# EAGLE design PTC Control V2 (EAGLE 8.6.3)
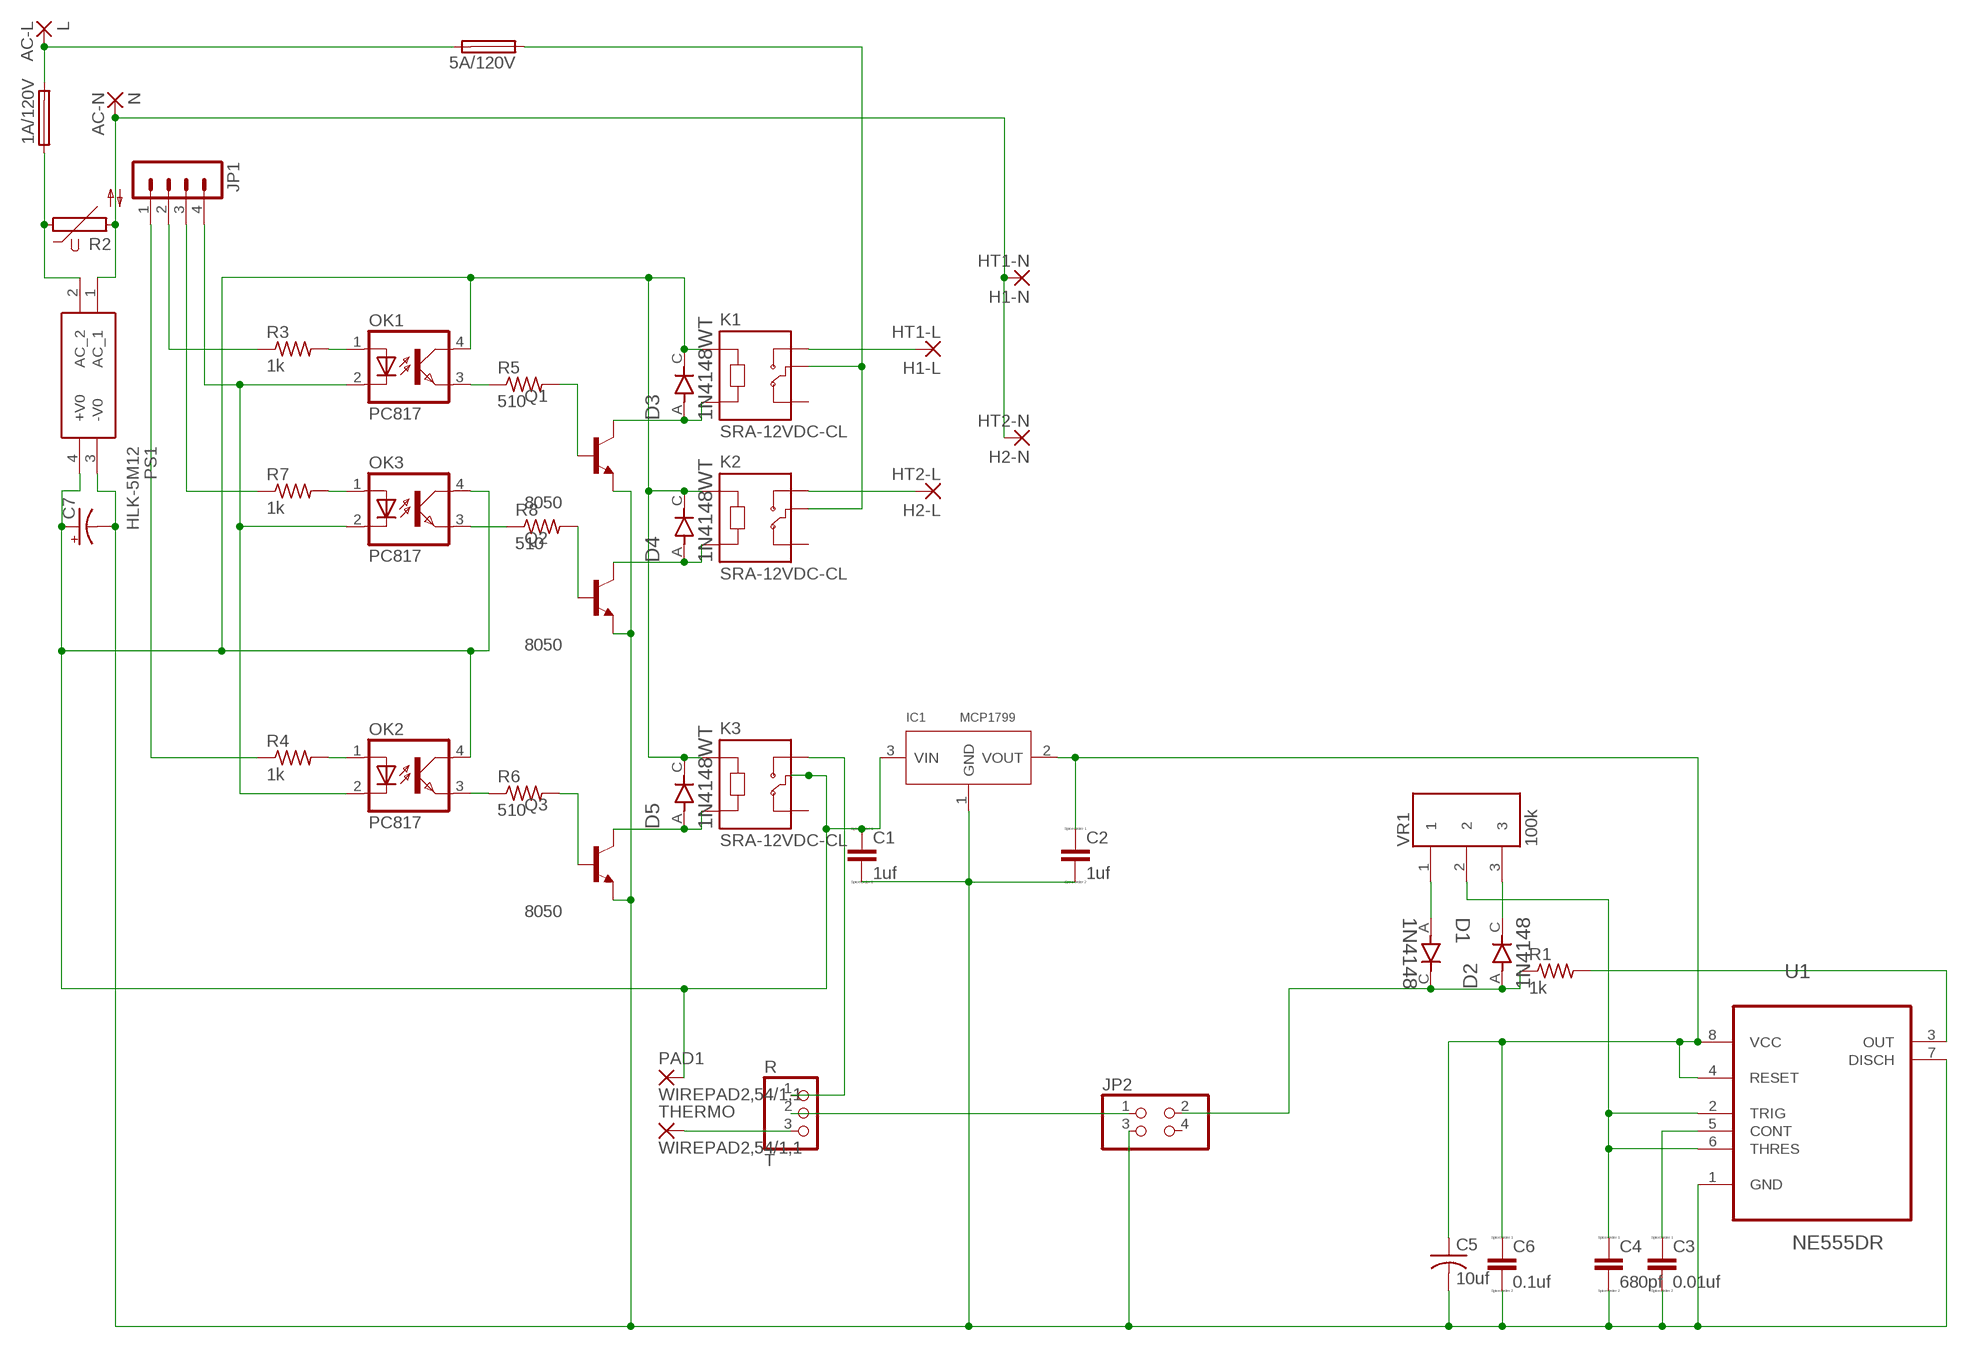
[diagram p0: schematic, sheet 1]

## Parts
1A/120V  SH25  [SH25]
5A/120V  SH25  [SH25]
C1  1uf  C  [C0805]
C2  1uf  C  [C0805]
C3  0.01uf  C  [C0805]
C4  680pf  C  [C0805]
C5  10uf  C-USC1206  [C1206]
C6  0.1uf  C  [C0805]
C7  CPOL-USE3.5-8  [E3,5-8]
D1  1N4148  1N4148WT  [SODFL1608X70N]
D2  1N4148  1N4148WT  [SODFL1608X70N]
D3  1N4148WT  [SODFL1608X70N]
D4  1N4148WT  [SODFL1608X70N]
D5  1N4148WT  [SODFL1608X70N]
H1-L  HT1-L  WIREPAD3,17/1,2  [3,17/1,2]
H1-N  HT1-N  WIREPAD3,17/1,2  [3,17/1,2]
H2-L  HT2-L  WIREPAD3,17/1,2  [3,17/1,2]
H2-N  HT2-N  WIREPAD3,17/1,2  [3,17/1,2]
IC1  MCP1799  PMIC-LDO-XC6206P252MR-G(SOT23)  [SOT-23]
JP1  MA04-1  [MA04-1]
JP2  PINHD-2X2  [2X02]
K1  SRA-12VDC-CL  1-1721150-3  [RELAY_1-1721150-3]
K2  SRA-12VDC-CL  1-1721150-3  [RELAY_1-1721150-3]
K3  SRA-12VDC-CL  1-1721150-3  [RELAY_1-1721150-3]
L  AC-L  WIREPAD3,81/1,4  [3,81/1,4]
N  AC-N  WIREPAD3,81/1,4  [3,81/1,4]
OK1  PC817  [DIL04]
OK2  PC817  [DIL04]
OK3  PC817  [DIL04]
PAD1  WIREPAD2,54/1,1  [2,54/1,1]
PS1  HLK-5M12  [HLK5M12]
Q1  8050  MMSS8050-H-TP  [TRANS_MMSS8050-H-TP]
Q2  8050  MMSS8050-H-TP  [TRANS_MMSS8050-H-TP]
Q3  8050  MMSS8050-H-TP  [TRANS_MMSS8050-H-TP]
R  T  PINHD-1X3  [1X03]
R1  1k  R-US_R0805  [R0805]
R2  S10K250  [S10K250]
R3  1k  R-US_R0805  [R0805]
R4  1k  R-US_R0805  [R0805]
R5  510  R-US_R0805  [R0805]
R6  510  R-US_R0805  [R0805]
R7  1k  R-US_R0805  [R0805]
R8  510  R-US_R0805  [R0805]
THERMO  WIREPAD2,54/1,1  [2,54/1,1]
U1  NE555DR  [SOIC127P600X175-8N]
VR1  100k  416XA503P  [TRIM_416XA503P]

## Nets
GND: C1.2 C2.2 C3.2 C4.2 C5.2 C6.2 C7.- IC1.1(GND) JP2.3 PS1.3(-V0) Q1.2(E) Q2.2(E) Q3.2(E) U1.1(GND) U1.7(DISCH)
N$1: JP2.1 R.2
N$2: C3.1 U1.5(CONT)
N$3: D1.A VR1.1
N$4: D2.C VR1.3
N$5: 1A/120V.1 PS1.2(AC_2) R2.1
N$6: R1.2 U1.3(OUT)
N$7: C4.1 U1.2(TRIG) U1.6(THRES) VR1.2
N$8: H1-N.1(P) H2-N.1(P) N.1(P) PS1.1(AC_1) R2.2
N$9: OK3.3(EMIT) R8.1
N$10: 5A/120V.1 K1.COM K2.COM
N$11: OK1.1(A) R3.2
N$12: OK2.1(A) R4.2
N$13: JP1.4 OK1.2(C) OK2.2(C) OK3.2(C)
N$14: JP1.1 R4.1
N$15: JP1.2 R3.1
N$16: OK1.3(EMIT) R5.1
N$17: OK2.3(EMIT) R6.1
N$18: Q3.1(B) R6.2
N$19: Q2.1(B) R8.2
N$20: JP1.3 R7.1
N$21: D4.A K2.A2 Q2.3(C)
N$23: D5.A K3.A2 Q3.3(C)
N$24: OK3.1(A) R7.2
N$25: Q1.1(B) R5.2
N$26: H1-L.1(P) K1.NO
N$27: D3.A K1.A2 Q1.3(C)
N$28: H2-L.1(P) K2.NO
N$29: 1A/120V.2 5A/120V.2 L.1(P)
N$30: K3.NO R.1
N$31: R.3 THERMO.1(P)
N$32: C1.1 C7.+ D3.C D4.C D5.C IC1.3(VIN) K1.A1 K2.A1 K3.A1 K3.COM OK1.4(COL) OK2.4(COL) OK3.4(COL) PAD1.1(P) PS1.4(+V0)
PWM-SIG: D1.C D2.A JP2.2 R1.1
VCC-5V: C2.1 C5.1 C6.1 IC1.2(VOUT) U1.4(RESET) U1.8(VCC)
Unconnected: JP2.4 K1.NC K2.NC K3.NC

## Library data of the parts
1A/120V 5A/120V = fuse:SH25: FUSE HOLDER grid 25 mm, OGN0031 8211, Schurter (Buerklin); MF: SCHURTER; MPN: 0031.8211; OC_FARNELL: 1162741; OC_NEWARK: 96B9380
C1-C4 C6 = eagle-ltspice:C: CAPACITOR, European symbol; SPICEMODEL: NONE; SPICEPREFIX: C
C5 = adafruit:C-US: CAPACITOR, American symbol
C7 = adafruit:CPOL-US: POLARIZED CAPACITOR, American symbol
D1-D5 = 1N4148WT:1N4148WT: Diode Switching 100V 0.125A 2-Pin SOD-523; AVAILABILITY: Unavailable; DESCRIPTION: Diode Standard 75V 200mA Surface Mount SOD-523F; MF: ON Semiconductor; MP: 1N4148WT; PACKAGE: S-9 Good-Ark; PRICE: None
H1-L H1-N H2-L H2-N L N PAD1 THERMO = wirepad:WIREPAD: Wire PAD connect wire on PCB
IC1 = PMIC-LDO-XC6206P252MR-G_SOT23_:PMIC-LDO-XC6206P252MR-G(SOT23): 310030014; AVAILABILITY: Unavailable; DESCRIPTION: Linear Voltage Regulator IC 1 Output 150mA SOT-23; MF: Torex; MP: XC6206P252MR-G; PACKAGE: SOT-23-3 Torex; PRICE: None
JP1 = con-lstb:MA04-1: PIN HEADER; OC_FARNELL: unknown; OC_NEWARK: unknown
JP2 = pinhead:PINHD-2X2: PIN HEADER
K1-K3 = PCB Relay-Small:1-1721150-3: ORWH Series Miniature PCB Relay with Wash Tight 1-Pole 1-Form C 1 CO 12 VDC 400 Ohm 360 mW Silver Zinc Oxide; AVAILABILITY: Unavailable; COMMENT: 1-1721150-3; DESCRIPTION: General Purpose Relay, ORWH Series, Power, Non Latching, SPDT, 12 VDC, 10 A; MF: TE Connectivity; MP: ORWH-SH-112D1F,000; PACKAGE: None; PRICE: None; TE_PURCHASE_URL: https://www.te.com/usa-en/product-1-1721150-3.html?te_bu=Cor&te_type=disp&te_campaign=seda_glo_cor-seda-global-disp-prtnr-fy19-seda-model-bom-cta_sma-317_1&elqCampaignId=32493
OK1-OK3 = optocoupler:PC817: SHARP OPTO COUPLER; MPN: PC817X4J000F; OC_FARNELL: 9707727; OC_NEWARK: 97K7059
PS1 = HLK-5M12:HLK-5M12: Power Module Source: Datasheet <http://www.hlktech.net/product_detail.php?ProId=64>; DESCRIPTION: Power Module; HEIGHT: 18mm; MANUFACTURER_NAME: Hi-Link; MANUFACTURER_PART_NUMBER: HLK-5M12
Q1-Q3 = MMSS8050-H-TP:MMSS8050-H-TP: MMSS8050-H Series 25 V 1.5 A NPN Silicon Plastic-Encapsulate Transistor-SOT-23; AVAILABILITY: Unavailable; DESCRIPTION: Bipolar _BJT_ Transistor NPN 25V 1.5A 100MHz 625mW Surface Mount SOT-23; MF: Micro Commercial; MP: MMSS8050-H-TP; PACKAGE: SOT-23 Micro Commercial; PRICE: None
R = pinhead:PINHD-1X3: PIN HEADER
R1 R3-R8 = adafruit:R-US_: RESISTOR, American symbol
R2 = varistor:S10K250: VARISTOR
U1 = TEL2426-Cust:NE555DR: PRECISION TIMERS; MPN: NE555DR; OC_FARNELL: 7527482; OC_NEWARK: 75C4440; PACKAGE: SOIC-8; SUPPLIER: Texas Instruments
VR1 = 416XA503P:416XA503P: TRIMMER 50K OHM 0.2W TH; AVAILABILITY: Unavailable; COMMENT: 1623895-9; DESCRIPTION: Res Cermet Trimmer 50K Ohm 25% 0.2W_1/5W_ 1_Elec_/1_Mech_Turn _6.8 X 7.45 X 8.4mm_ Pin Thru-Hole; MF: TE Connectivity; MP: 416XA503P; PACKAGE: TE Connectivity; PRICE: None; TE_PURCHASE_URL: https://www.te.com/usa-en/product-1623895-9.html?te_bu=Cor&te_type=disp&te_campaign=seda_glo_cor-seda-global-disp-prtnr-fy19-seda-model-bom-cta_sma-317_1&elqCampaignId=32493

## Board
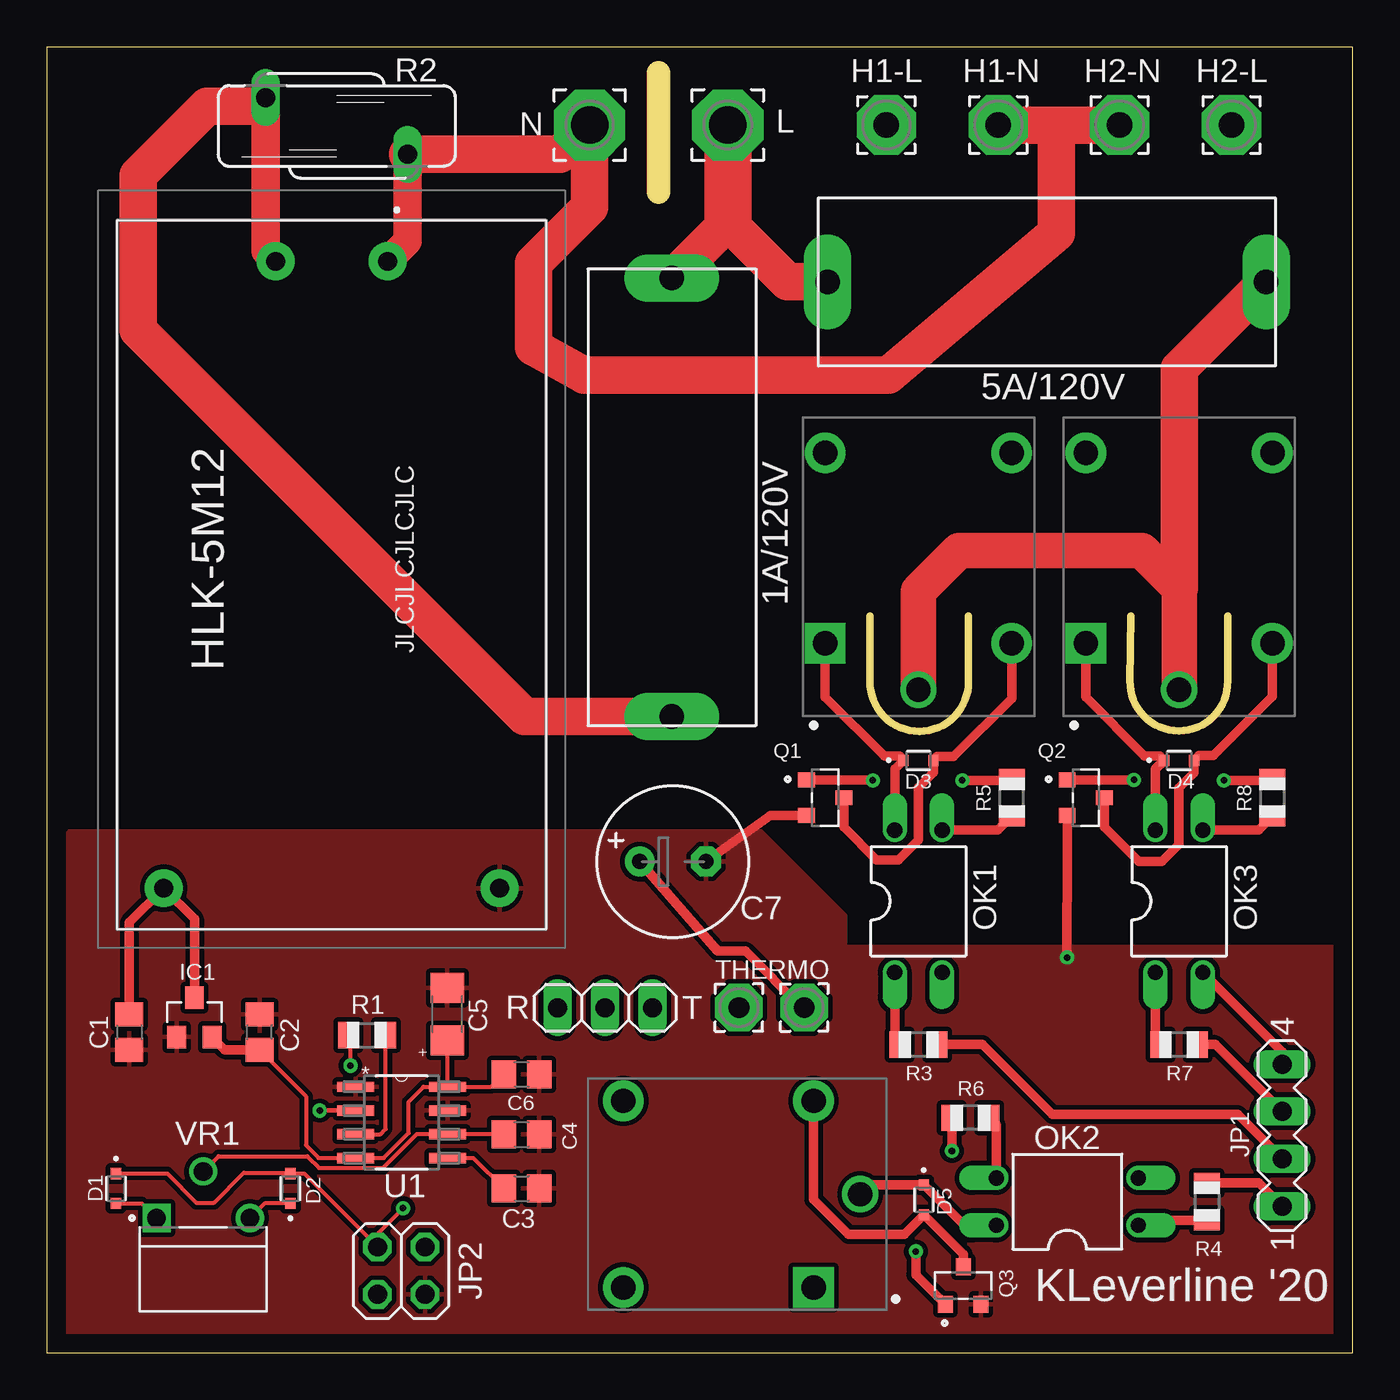
[diagram p1: board, top side]
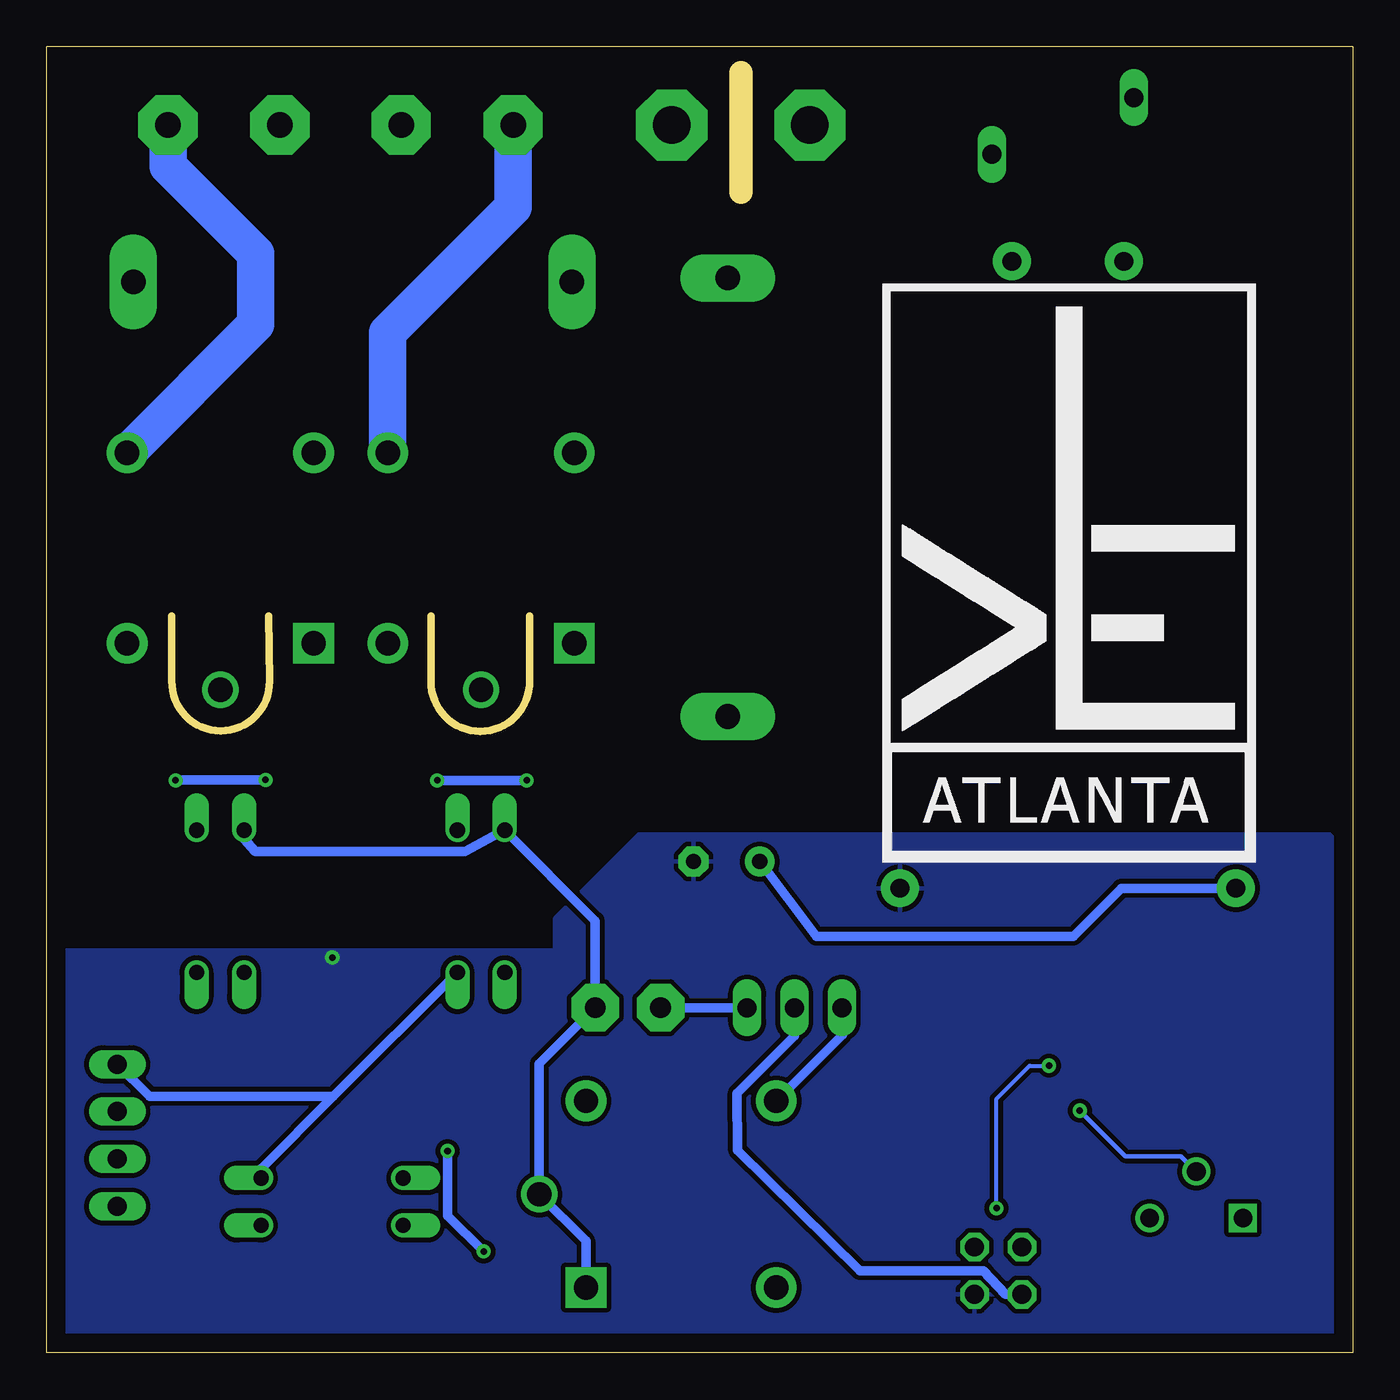
[diagram p2: board, bottom side, seen from below]

Size 70 x 70 mm. Coordinates in mm from the lower left corner, seen from the top.
Outline: 44.12,39.5 44.12,36 arc182 49.4,36 49.4,39.5
Outline: 58.09,39.5 58.06,36 arc182 63.29,36 63.29,39.5
Outline: 32.8,68.6 32.8,62.2
Outline: 0,0 70,0 70,70 0,70 0,0
Copper layers (1*16): Top 0.035mm / dielectric 1.5mm / Bottom 0.035mm
Design rules "default": minimum track width 6mil, minimum drill 0.35mm, track to track 6mil, track to pad 6mil, pad to pad 6mil, via to via 6mil, smd to smd 6mil, copper to edge 40mil, drill to drill 6mil, minimum pad ring 10mil, minimum via ring 8mil, stop-mask expansion 4mil, vias tented up to drill 0mil, thermal gap 10mil

### Footprints (pad centres in the part's own frame; a part is rotated, then mirrored left to right if it is on the bottom)
SH25 = drill 1.321 pad 2.54 long: 1 -11.75,0; 2 11.75,0
C0805 = smd 1.3 x 1.5: 1 -0.95,0; 2 0.95,0
C1206 = smd 1.6 x 1.8: 1 -1.4,0; 2 1.4,0
E3,5-8 = drill 0.813 pad 1.6: + -1.778,0 | drill 0.813 pad 1.6 octagon: - 1.778,0
SODFL1608X70N = smd 0.61 x 0.61: A 0.8,0; C -0.8,0
3,17/1,2 = drill 1.372 pad 3.175 octagon: 1 0,0
SOT-23 = smd 1.016 x 1.2: 1 -0.95,-1.06; 2 0.95,-1.06; 3 0,1.06
MA04-1 = drill 1.016 long: 1 -3.81,0; 2 -1.27,0; 3 1.27,0; 4 3.81,0
2X02 = drill 1.016 octagon: 1 -1.27,-1.27; 2 -1.27,1.27; 3 1.27,-1.27; 4 1.27,1.27
RELAY_1-1721150-3 = drill 1.3 pad 2.184 square: A1 -4.1,5 | drill 1.3 pad 2.184: A2 -4.1,-5; NC 6.1,5; NO 6.1,-5 | drill 1.3: COM -6.6,0
3,81/1,4 = drill 2 pad 3.81 octagon: 1 0,0
DIL04 = drill 0.813 offset: 1 -1.27,-3.81; 2 1.27,-3.81; 3 1.27,3.81; 4 -1.27,3.81
2,54/1,1 = drill 1.118 pad 2.54 octagon: 1 0,0
HLK5M12 = drill 1 pad 2.032: 1 0,0; 2 0,-6; 3 33.6,6; 4 33.6,-12
TRANS_MMSS8050-H-TP = smd 0.9 x 0.8: 1 -1,0.95; 2 -1,-0.95; 3 1,0
1X03 = drill 1.016 long: 1 -2.54,0; 2 0,0; 3 2.54,0
R0805 = smd 1.1 x 1.4: 1 -1,0; 2 1,0
S10K250 = drill 1.016 long: 1 -1.524,-3.81; 2 1.524,3.81
SOIC127P600X175-8N = smd 1.981 x 0.559: 1 -2.464,1.905; 2 -2.464,0.635; 3 -2.464,-0.635; 4 -2.464,-1.905; 5 2.464,-1.905; 6 2.464,-0.635; 7 2.464,0.635; 8 2.464,1.905
TRIM_416XA503P = drill 1 square: 1 -2.5,0 | drill 1: 2 0,2.5; 3 2.5,0

### Placement (x,y rotation side)
1A/120V  33.5,45.85 90 top
5A/120V  53.6,57.4 180 top
C1  4.43,17.19 270 top
C2  11.41,17.19 90 top
C3  25.45,8.81 0 top
C4  25.45,11.71 0 top
C5  21.47,18.15 90 top
C6  25.45,14.93 0 top
C7  33.56,26.33 0 top
D1  3.72,8.81 270 top
D2  13.06,8.81 90 top
D3  46.72,31.75 0 top
D4  60.69,31.75 0 top
D5  47.01,8.2 270 top
H1-L  45,65.8 0 top
H1-N  51,65.8 0 top
H2-L  63.5,65.8 0 top
H2-N  57.5,65.8 0 top
IC1  7.92,17.98 0 top
JP1  66.21,11.66 90 top
JP2  19,4.4 0 top
K1  46.72,42.13 90 top
K2  60.69,42.13 90 top
K3  37,8.5 180 top
L  36.5,65.8 0 top
N  29.1,65.8 0 top
OK1  46.72,24.2 0 top
OK2  54.7,8.1 90 top
OK3  60.69,24.2 0 top
PAD1  40.6,18.5 0 top
PS1  18.27,58.5 270 top
Q1  41.72,29.75 0 top
Q2  55.69,29.75 0 top
Q3  49.12,3.61 90 top
R  29.93,18.49 0 top
R1  17.17,17.03 0 top
R2  15.54,65.75 270 top
R3  46.72,16.52 180 top
R4  62.17,8.11 270 top
R5  51.72,29.75 90 top
R6  49.5,12.6 180 top
R7  60.69,16.52 180 top
R8  65.69,29.75 90 top
THERMO  37.1,18.5 0 top
U1  19.02,12.35 0 top
U$1  [LOGO-FINAL]  25.2,26.3 0 bottom
VR1  8.39,7.22 0 top

### Tracks (layer width: path | path; a pad name or v marks a point on that pad's centre or on a via)
GND  (via drill 0.35)
  Top 0.508: Q1.2 38.78,28.8 C7.- | v54.69,21.18 54.69,27.11 Q2.2
  pour Bottom (isolate 0.254): 0,26.6 1.2,27.8 38.3,27.8 42.8,23.3 42.8,21.6 70,21.6 70,0 0.1,-0.1
  pour Top (isolate 0.254): 0,26.8 1.2,28 38.3,28 42.8,23.5 42.8,21.8 70,21.8 70,0.2 0.1,0.1
N$1
  Bottom 0.508: JP2.1 18.62,3.13 19.79,4.4 26.42,4.4 32.97,10.85 32.99,13.92 29.93,16.99 R.2
N$2
  Top 0.203: U1.5 22.86,10.45 C3.1
N$3
  Top 0.203: D1.A 5.1,8.01 VR1.1
N$4
  Top 0.203: D2.C 11.68,8.01 VR1.3
N$5
  Top 1.54: 11.26,66.8 R2.1 11.73,59.04 PS1.2
  Top 2: 1A/120V.1 25.6,34.1 4.9,54.8 4.9,63.1 8.6,66.8 11.26,66.8
N$6
  Top 0.203: U1.3 17.89,11.71 18.17,12 R1.2
N$7  (via drill 0.35)
  Top 0.203: C4.1 U1.6 19.84,11.71 18.04,9.91 14.6,9.91 13.97,10.54 9.21,10.54 VR1.2
  Top 0.254: U1.2 v14.64,12.98 v14.63,12.98
  Bottom 0.254: v14.63,12.98 12.19,10.54 9.21,10.54 VR1.2
N$8
  Top 1.54: R2.2 19.35,59.58 PS1.1
  Top 2: R2.2 27.53,64.23 N.1 29.1,61.4 26.1,58.4 26.1,53.9 28.8,52.4 45.1,52.4 54.1,60 54.1,65.8 | H1-N.1 54.1,65.8 | 54.1,65.8 H2-N.1
N$9
  Top 0.508: OK3.3 64.95,28.01 R8.1
N$10
  Top 1.9: K2.COM 60.69,41 58.69,43 48.9,43 46.72,40.82 K1.COM
  Top 2: 5A/120V.1 60.69,52.74 60.69,41
N$11
  Top 0.508: OK1.1 45.45,16.79 R3.2
N$12
  Top 0.508: R4.2 58.79,7.11 OK2.1
N$13
  Top 0.508: OK3.2 66.21,16.14 JP1.4
  Bottom 0.508: OK1.2 54.64,13.74 | JP1.4 64.48,13.74 54.64,13.74 | 54.64,13.74 58.51,9.87 OK2.2
N$14
  Top 0.508: R4.1 64.95,9.11 JP1.1
N$15
  Top 0.508: R3.1 50.16,16.52 53.9,12.78 63.82,12.78 JP1.2
N$16
  Top 0.508: OK1.3 50.98,28.01 R5.1
N$17
  Top 0.508: OK2.3 50.89,12.21 R6.1
N$18  (via drill 0.35)
  Top 0.508: R6.2 48.5,10.83 v48.51,10.82 | v46.58,5.44 46.58,4.2 Q3.1
  Bottom 0.508: v48.51,10.82 48.51,9.82 48.5,9.81 48.5,7.35 v46.58,5.44
N$19  (via drill 0.35)
  Top 0.508: Q2.1 v58.26,30.7 v58.27,30.71 | v63.09,30.68 65.62,30.68 R8.2
  Bottom 0.508: v58.27,30.71 63.07,30.71 v63.09,30.68
N$20
  Top 0.508: JP1.3 62.62,16.52 R7.1
N$21
  Top 0.508: K2.A2 65.69,35.17 62.52,32 61.74,32 D4.A 61.49,31.09 60.68,30.28 60.68,27.25 59.77,26.34 58.52,26.34 56.69,28.17 Q2.3
N$23
  Top 0.508: K3.A2 41.1,8.23 42.98,6.35 45.96,6.35 D5.A 49.12,5.29 Q3.3
N$24
  Top 0.508: R7.2 59.42,16.79 OK3.1
N$25  (via drill 0.35)
  Top 0.508: Q1.1 44.26,30.7 v44.27,30.68 | v49.07,30.68 51.65,30.68 R5.2
  Bottom 0.508: v44.27,30.68 v49.07,30.68
N$26
  Bottom 2: K1.NO 51.72,54.68 45,61.4 H1-L.1
N$27
  Top 0.508: K1.A2 51.72,35.08 48.59,31.95 47.72,31.95 D3.A 47.52,31.11 46.71,30.3 46.71,27.48 45.64,26.42 44.48,26.42 42.72,28.17 Q1.3
N$28
  Bottom 2: K2.NO 58.8,55.12 58.8,58.9 63.5,63.6 H2-L.1
N$29
  Top 2: 1A/120V.2 36.5,60.6 39.7,57.4 5A/120V.2
  Top 2.54: L.1 36.5,60.6
N$30
  Bottom 0.508: R.1 27.36,17.04 K3.NO
N$31
  Bottom 0.508: R.3 37.09,18.49
  Bottom 0.61: 37.09,18.49 THERMO.1
N$32
  Top 0.508: K1.A1 41.72,35.16 44.9,31.98 45.69,31.98 D3.C 45.45,31.28 OK1.4 | K2.A1 55.69,35.14 58.84,31.99 59.65,31.99 D4.C 59.42,31.28 OK3.4 | K3.COM 44.1,9 D5.C 49.18,6.83 OK2.4 | IC1.3 7.92,23.25 PS1.4 4.43,23.06 C1.1 | C7.+ 35.96,21.54 37.44,21.54 40.48,18.5 PAD1.1
  Bottom 0.508: OK3.4 59.42,27.54 58.83,26.87 47.58,26.87 OK1.4 40.6,23.16 PAD1.1 43.6,15.5 K3.COM 41.1,6 K3.A1 | PS1.4 12.41,24.9 14.99,22.33 28.75,22.33 C7.+
PWM-SIG  (via drill 0.35)
  Top 0.203: D1.C 6.47,9.61 8.03,8.05 8.97,8.05 10.57,9.65 13.02,9.65 D2.A 13.79,9.61 JP2.2 17.73,6.38 v19.1,7.75 | v16.28,15.39 16.28,16.92 R1.1
  Bottom 0.203: v19.1,7.75 19.1,13.61 17.32,15.39 v16.28,15.39
VCC-5V
  Top 0.203: C2.1 13.89,13.76 13.89,11.12 14.57,10.45 U1.4 18.07,10.45 19.41,11.79 19.41,13.46 20.2,14.26 U1.8 | U1.8 23.82,14.26 C6.1 | U1.8 21.48,16.74 C5.1
  Top 0.508: IC1.2 9.55,16.24 C2.1

### Text on the board
tNames: JLCJLCJLCJLC | HLK-5M12 | T | + | KLeverline '20